# Altium schematic sheet Copy of ADC_schematic_Brad.SchDoc
size A
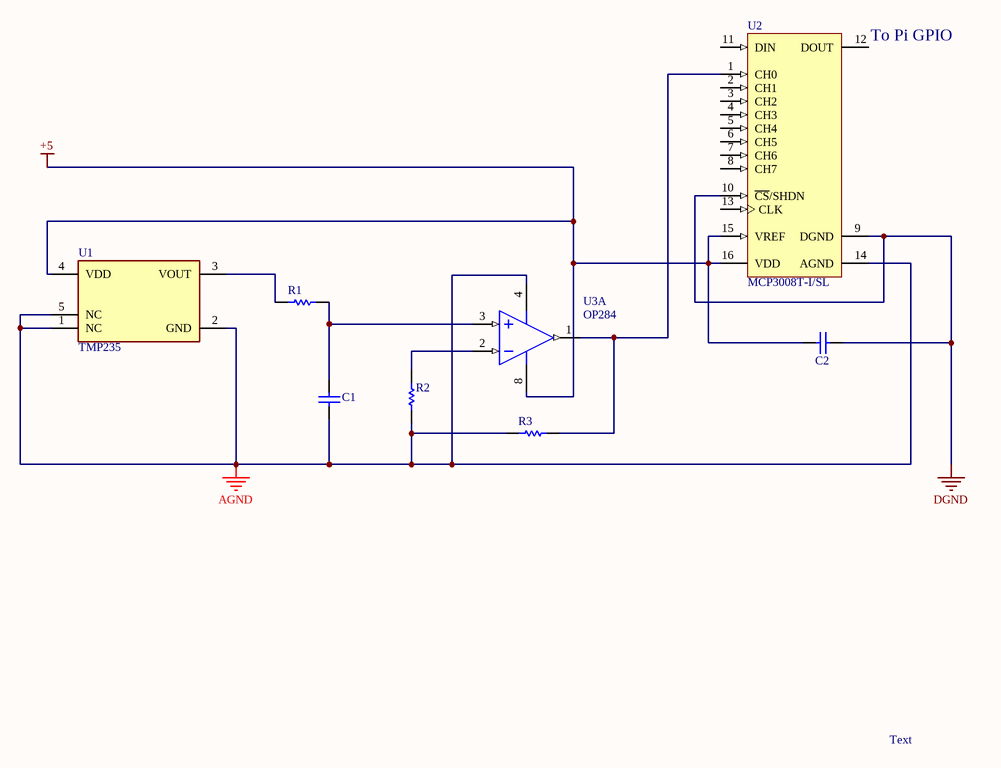
[diagram p0: Copy of ADC_schematic_Brad.SchDoc]

## Parts
C1  (no value)  [CAPC3216X180X50ML20T25]
C2  1 uF, 50V 1206(3216)  [CAPC3216X125X55LL15T25]  (value not drawn)
R1  10K 2010(5025)  [RESC2010(5025)_L]  (value not drawn)
R2  10K 2010(5025)  [RESC2010(5025)_L]  (value not drawn)
R3  6K8 2010(5025)  [RESC2010(5025)_N]  (value not drawn)
U1  TMP235  [FP-DCK0005A-MFG]
U2  MCP3008T-I/SL  [SOIC-SL16_N]
U3  OP284  [ADI-R-8_N]  (part A of 2)

## Nets
+5: C2.1 U1.4(VDD) U2.15(VREF) U2.16(VDD) U3.8(+V)
AGND: C1.1 R2.1 R3.1 U1.1(NC) U1.2(GND) U1.5(NC) U2.14(AGND) U3.4(-V)
DGND: C2.2 U2.9(DGND) U2.10(~{CS}/SHDN)
NetC1_2: C1.2 R1.2 U3.3(+IN_A)
NetR1_1: R1.1 U1.3(VOUT)
NetR2_2: R2.2 U3.2(-IN_A)
NetR3_2: R3.2 U2.1(CH0) U3.1(OUT_A)

Not connected (* = marked no-connect by the designer): U2 2(CH1) 3(CH2) 4(CH3) 5(CH4) 6(CH5) 7(CH6) 8(CH7) 11(DIN) 12(DOUT) 13(CLK)

## Notes on the sheet
- (near U2) To Pi GPIO
- Text

## Library data of the parts
C1 = CMP-1661-00005-1: Multilayer Ceramic Capacitor, 10 uF, +/- 10%, 16 V, 1206 (3216 Metric), -55 to 125 degC, RoHS, Tape and Reel; Case\Package: 0603; Tolerance: 1%; Power Rating: 100 mW; Resistance: 330 Ohm; Voltage Rating: 75 V; Width: 0.8 mm; REACH SVHC: Yes; Case Code (Metric): 1608; Pins: 2; ComponentLink2URL: http://datasheets.avx.com/X7RDielectric.pdf; Height: 0.45 mm; Max Operating Temperature: 155 degC; ComponentLink1Description: Manufacturer URL; ComponentLink1URL: http://www.avx.com/; ComponentLink2Description: Datasheet; PackageReference: 1206; Weight: 7.1E-05 oz; Min Operating Temperature: -55 degC; Case Code (Imperial): 0603; DatasheetVersion: Jul-16; RoHSCompliant: true; Packaging: Tape and Reel; Length: 1.6 mm; PackageDescription: 2-Pin Surface Mount Device, Body 3.2 x 1.6 mm; Package Quantity: 5000; Radiation Hardening: No; Mount: Surface Mount
C2 = CMP-2000-06356-1: Chip Capacitor, 1 uF, +/- 10%, 50 V, -55 to 125 degC, 1206 (3216 Metric), RoHS, Tape and Reel; Manufacturer: Murata; Case Width: 1.6mm; Dielectric: X7R; Case Length: 3.2mm; Case Height: 1.15mm; Capacitance: 1uF; Type: GeneralPurposeMLCC; Brand: MurataElectronics; Product: GeneralTypeMLCCs; Factory Pack Quantity: 3000; Packaging: Reel; Case Code - mm: 3216; Datasheet Version: 03/2016; Manufacturer URL: http://www.murata.com/; Tolerance: 10%; Case Code - in: 1206; Product Category: MultilayerCeramicCapacitorsMLCC-SMD/SMT; Series: GRM; Package Description: 2-Pin Surface Mount Device, Body 3.2 x 1.6 mm; Mounting Technology: SurfaceMount; Maximum Operating Temperature: +125C; RoHS: Details; Minimum Operating Temperature: -55C; Package Reference: 1206; Voltage Rating DC: 50V; Datasheet URL: http://search.murata.co.jp/Ceramy/image/img/A01X/G101/ENG/GRM31MR71H105KA88-01.pdf; Package / Case: 1206(3216metric); Termination Style: SMD/SMT
R1 R2 = CMP-1017-00098-1: 10K 0.75W 5% 2010 (5025 Metric)  SMD; Case-EIA: 2010; Value: 10000.00 Ohm; Case-Metric: 5025; Technology: SMT; Tolerance: 5 %; Power: 0.75 W
R3 = CMP-1017-00604-1: 6K8 0.75W 1% 2010 (5025 Metric)  SMD; Value: 6800.00 Ohm; Case-EIA: 2010; Case-Metric: 5025; Technology: SMT; Power: 0.75 W; Tolerance: 1 %
U1 = CMP-04948-000022-1: SENSOR ANALOG -40C-150C SC70-5; Manufacturer Part Number: TMP235A4DCKR; Manufacturer: Texas Instruments; Max Junction Temp: +150°C; Output Current: 500uA; Standoff Height: 0mm; Output Voltage: 100-2000mV; Operating Supply Current: 9-10uA; Min Supply Voltage: 2.3V; Sensor Output: Analog Voltage; Max Supply Voltage: 5.5V; Ambient Temperature Range High: +150°C; Temperature Range Low: -40°C; Temperature Range High: +150°C; Lead Free: Yes; Mouser Description: ±2.5°C Analog output temperature sensor, with 10mV /°C gain 5-SC70 -40 to 150; Height: 1.1mm; ComponentLink2Description: Datasheet; ComponentLink2URL: https://www.ti.com/lit/ds/symlink/tmp235.pdf; Device Class L1: Sensors; Ambient Temperature Range Low: -40°C; Temperature: -40°C to +150°C; Device Class L2: Temperature and Humidity Sensors; Category: IC; Digikey Description: SENSOR ANALOG -40C-150C SC70-5; Automotive: No; RoHS: TRUE; Device Class L3: unset; Package: DCK0005A; Octopart: https://octopart.com/tmp235a4dckr-texas+instruments-88184449
U2 = CMP-0188-00351-2: 2.7V 4-Channel/8-Channel 10-Bit A/D Converters with SPI Serial Interface, 16-Pin SOIC 150mil, Industrial Temperature, Tape and Reel; ComponentLink2Description: Datasheet; Code_JEDEC: MS-012-AC; Code_IPC: SOIC127P600-16; ComponentLink1Description: Manufacturer URL; DatasheetVersion: revD, Dec-2008; PackageReference: SOIC-SL16; ComponentLink2URL: http://ww1.microchip.com/downloads/en/DeviceDoc/21295d.pdf; ComponentLink3Description: Package Specification; ComponentLink3URL: http://www.microchip.com/stellent/groups/techpub_sg/documents/packagingspec/en012702.pdf; PackageVersion: revBB, Aug-2009; RevisionNote: URLs added.; PackageDescription: 16-Lead Plastic Small Outline (SL) - Narrow, 3.90mm Body [SOIC]; ComponentLink1URL: http://www.microchip.com/
U3 = CMP-0384-00699-1: Double Channel Single-Supply Operation Operational Amplifier, 4.25 MHz BW, 4 V/us SR, Industrial, 8-pin SOIC (R-8), Tube; PartNumber: OP284FSZ; Manufacturer: Analog Devices; Input Bias Current: 80nA; Input Offset Voltage: 175uV; V Span Max: 36V; Slew Rate: 4V/us; Amplifiers Per Package: 2; Iq/Amp: 2mA; V Span Min: 3V; PackageDescription: 8-Pin Standard Small Outline Package, Body 3.9 x 4.9 mm, Pitch 1.27 mm; ComponentLink3URL: http://www.analog.com/static/imported-files/packages/PKG_PDF/SOIC_Narrow%20(R)/R_8.pdf; Mounting Technology: Surface Mount; ComponentLink3Description: Package Specification; ComponentLink1Description: Manufacturer URL; ComponentLink1URL: http://www.analog.com/en/index.html; Generic Part Number: OP284; ComponentLink2Description: Datasheet; DatasheetVersion: Rev. J; ComponentLink2URL: http://www.analog.com/static/imported-files/data_sheets/OP184_284_484.pdf; PackageReference: R-8; Small Signal Bandwidth: 4.25MHz; PackageVersion: 060506-A; Code_JEDEC: MS-012-AA